# Altium schematic sheet main.SchDoc
size A4
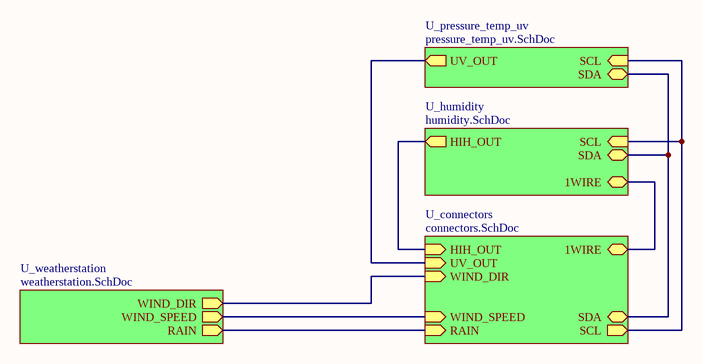
[diagram p0: main.SchDoc]

## Sub-sheets
U_connectors = connectors.SchDoc: WIND_DIR (in), UV_OUT (in), HIH_OUT (in), WIND_SPEED (in), RAIN (in), SCL (out), SDA (bidir), 1WIRE (bidir)
U_humidity = humidity.SchDoc: HIH_OUT (out), SCL (in), SDA (bidir), 1WIRE (bidir)
U_pressure_temp_uv = pressure_temp_uv.SchDoc: UV_OUT (out), SCL (in), SDA (bidir)
U_weatherstation = weatherstation.SchDoc: RAIN (out), WIND_DIR (out), WIND_SPEED (out)

## Nets
(unnamed): sheet U_connectors/WIND_DIR, sheet U_weatherstation/WIND_DIR
(unnamed): sheet U_connectors/UV_OUT, sheet U_pressure_temp_uv/UV_OUT
(unnamed): sheet U_connectors/HIH_OUT, sheet U_humidity/HIH_OUT
(unnamed): sheet U_connectors/WIND_SPEED, sheet U_weatherstation/WIND_SPEED
(unnamed): sheet U_connectors/RAIN, sheet U_weatherstation/RAIN
(unnamed): sheet U_connectors/SCL, sheet U_humidity/SCL, sheet U_pressure_temp_uv/SCL
(unnamed): sheet U_connectors/SDA, sheet U_humidity/SDA, sheet U_pressure_temp_uv/SDA
(unnamed): sheet U_connectors/1WIRE, sheet U_humidity/1WIRE

## Notes on the sheet
- Title
- Size:
- Date:
- A4
- Number:
- Time:
- Revision:
- Sheet
- of
- File: